# Altium schematic sheet ShineRider.SchDoc
size A3; SheetNumber: 1; SheetTotal: 1
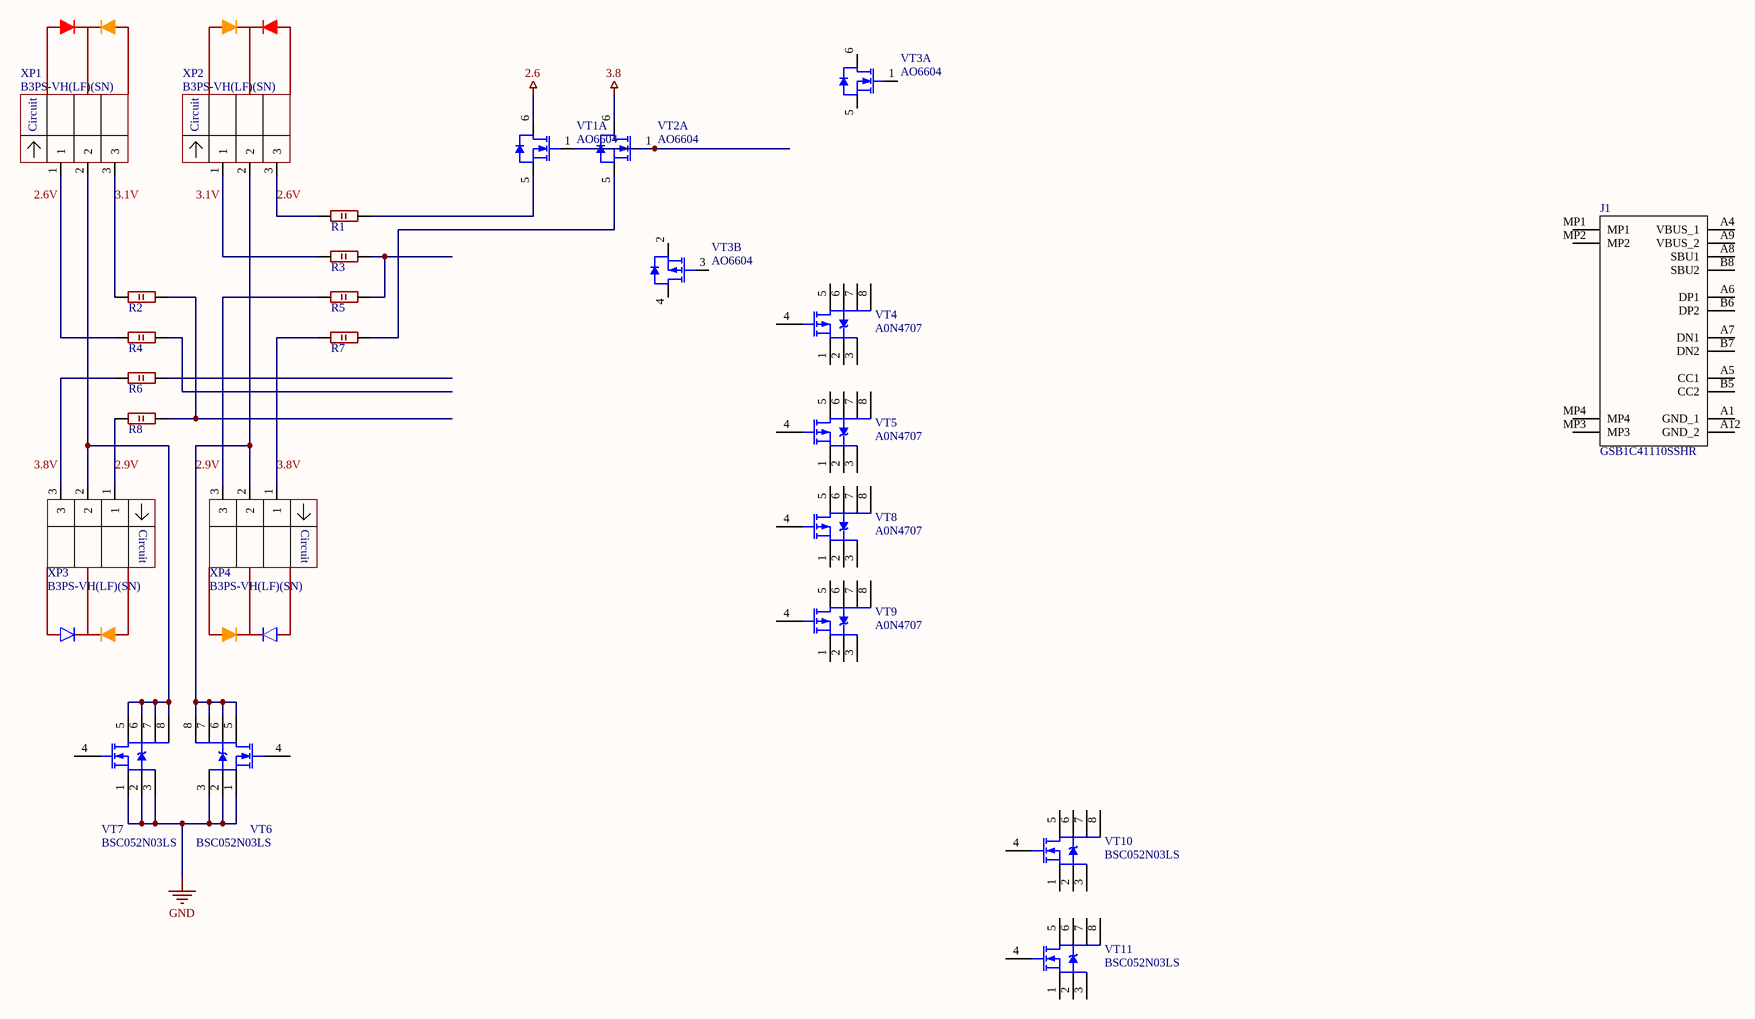
[diagram p0: ShineRider.SchDoc]

## Parts
J1  GSB1C41110SSHR  [GSB1C41110SSHR]
R1  0.1R 1%  [R2512]  (value not drawn)
R2  0.1R 1%  [R2512]  (value not drawn)
R3  0.1R 1%  [R2512]  (value not drawn)
R4  0.1R 1%  [R2512]  (value not drawn)
R5  0.1R 1%  [R2512]  (value not drawn)
R6  0.1R 1%  [R2512]  (value not drawn)
R7  0.1R 1%  [R2512]  (value not drawn)
R8  0.1R 1%  [R2512]  (value not drawn)
VT1  AO6604  [TSOP-6]  (part A of 2)
VT2  AO6604  [TSOP-6]  (part A of 2)
VT3  AO6604  [TSOP-6]  (parts A,B of 2)
VT4  A0N4707  [PG-TDSON-8]
VT5  A0N4707  [PG-TDSON-8]
VT6  BSC052N03LS  [PG-TDSON-8]
VT7  BSC052N03LS  [PG-TDSON-8]
VT8  A0N4707  [PG-TDSON-8]
VT9  A0N4707  [PG-TDSON-8]
VT10  BSC052N03LS  [PG-TDSON-8]
VT11  BSC052N03LS  [PG-TDSON-8]
XP1  B3PS-VH(LF)(SN)  [B3PS-VH(LF)(SN)]
XP2  B3PS-VH(LF)(SN)  [B3PS-VH(LF)(SN)]
XP3  B3PS-VH(LF)(SN)  [B3PS-VH(LF)(SN)]
XP4  B3PS-VH(LF)(SN)  [B3PS-VH(LF)(SN)]

## Nets
2.6: VT1.6(D1)
3.8: VT2.6(D1)
GND: VT6.1(S1) VT6.2(S2) VT6.3(S3) VT7.1(S1) VT7.2(S2) VT7.3(S3)
NetR1_1: R1.1 XP2.3
NetR1_2: R1.2 VT1.5(S1)
NetR2_1: R2.1 XP1.3
NetR2_2: R2.2 R8.2
NetR3_1: R3.1 XP2.1
NetR3_2: R3.2 R5.2
NetR4_1: R4.1 XP1.1
NetR5_1: R5.1 XP4.3
NetR6_1: R6.1 XP3.3
NetR7_1: R7.1 XP4.1
NetR7_2: R7.2 VT2.5(S1)
NetR8_1: R8.1 XP3.1
NetVT1_1: VT1.1(G1) VT2.1(G1)
NetVT6_5: VT6.5(D6) VT6.6(D6) VT6.7(D7) VT6.8(D8) XP2.2 XP4.2
NetVT7_5: VT7.5(D6) VT7.6(D6) VT7.7(D7) VT7.8(D8) XP1.2 XP3.2

Not connected (* = marked no-connect by the designer): J1 A1(GND_1) A4(VBUS_1) A5(CC1) A6(DP1) A7(DN1) A8(SBU1) A9(VBUS_2) A12(GND_2) B5(CC2) B6(DP2) B7(DN2) B8(SBU2) MP1 MP2 MP3 MP4; R4 2; R6 2; VT3 1(G1) 2(S2) 3(G2) 4(D2) 5(S1) 6(D1); VT4 1(S1) 2(S2) 3(S3) 4(G) 5(D6) 6(D6) 7(D7) 8(D8); VT5 1(S1) 2(S2) 3(S3) 4(G) 5(D6) 6(D6) 7(D7) 8(D8); VT6 4(G); VT7 4(G); VT8 1(S1) 2(S2) 3(S3) 4(G) 5(D6) 6(D6) 7(D7) 8(D8); VT9 1(S1) 2(S2) 3(S3) 4(G) 5(D6) 6(D6) 7(D7) 8(D8); VT10 1(S1) 2(S2) 3(S3) 4(G) 5(D6) 6(D6) 7(D7) 8(D8); VT11 1(S1) 2(S2) 3(S3) 4(G) 5(D6) 6(D6) 7(D7) 8(D8)

## Notes on the sheet
- (near XP1) 2.6V
- (near XP1) 3.1V
- (near XP2) 3.1V
- 2.6V
- (near XP3) 3.8V
- 2.9V
- (near XP4) 2.9V
- (near XP4) 3.8V
- (in symbol B3PS-VH(LF)(SN)) Circuit

## Library data of the parts
J1 = GSB1C41110SSHR: USB-C (USB TYPE-C) USB 2.0 Receptacle Connector 24 (16+8 Dummy) Position Surface Mount, Right Angle; Through Hole; Manufacturer_Name: Amphenol Communications Solutions; Datasheet Link: https://cdn.amphenol-cs.com/media/wysiwyg/files/drawing/gsb1c41x10sshr-ax1.pdf; Height: 3.41mm; Manufacturer_Part_Number: GSB1C41110SSHR; Part Number: GSB1C41110SSHR; HelpURL: https://www.digikey.com/en/products/detail/amphenol-cs-commercial-products/GSB1C41110SSHR/21623839; Digi-Key Part Number: 664-GSB1C41110SSHRCT-ND; Price$: 0.69
R1-R8 = MFHA2512R1000FE: 100 mOhms ±1% 2W Chip Resistor 2512; Part Number: MFHA2512R1000FE; HelpURL: https://www.digikey.com/en/products/detail/eaton-electronics-division/MFHA2512R1000FE/16713307; Manufacturer Part Number: MFHA2512R1000FE; Package: 2512
VT1-VT3 = AO6604: Mosfet Array N and P-Channel Complementary 20V 3.4A, 2.5A 1.1W Surface Mount 6-TSOP; Part Number: AO6604; HelpURL: https://www.digikey.com/product-detail/en/alpha-omega-semiconductor-inc/AO6604/785-1078-1-ND/1856021; Digi-Key Part Number: 785-1078-1-ND; Price$: 0.43; Manufacturer Part Number: AO6604
VT4 VT5 VT8 VT9 = A0N4707: P-Channel 20V 14.5A (Ta), 40A (Tc) 3.1W (Ta), 29W (Tc) Surface Mount 8-DFN (3x3); Part Number: A0N4707; HelpURL: https://www.digikey.com/product-detail/en/alpha-omega-semiconductor-inc/AON7407/785-1306-1-ND/3061125
XP1-XP4 = B3PS-VH(LF)(SN): CONN HEADER VH SIDE 3POS 3.96MM; Part Number: B3PS-VH(LF)(SN); HelpURL: https://www.digikey.com/products/en?keywords=B3PS-VH(LF)(SN)
VT6 VT7 VT10 VT11 = BSC052N03LS: Part Number: BSC052N03LS; HelpURL: https://www.digikey.com/product-detail/en/infineon-technologies/BSC052N03LSATMA1/BSC052N03LSATMA1CT-ND/3196621